# EasyEDA schematic SCH_vs-demon_v1.json
TITLE: Sheet_1; REV: 1.0; Date: 2023-12-21; Sheet: 1/1; Drawn By: aditz26; Company: Your Company
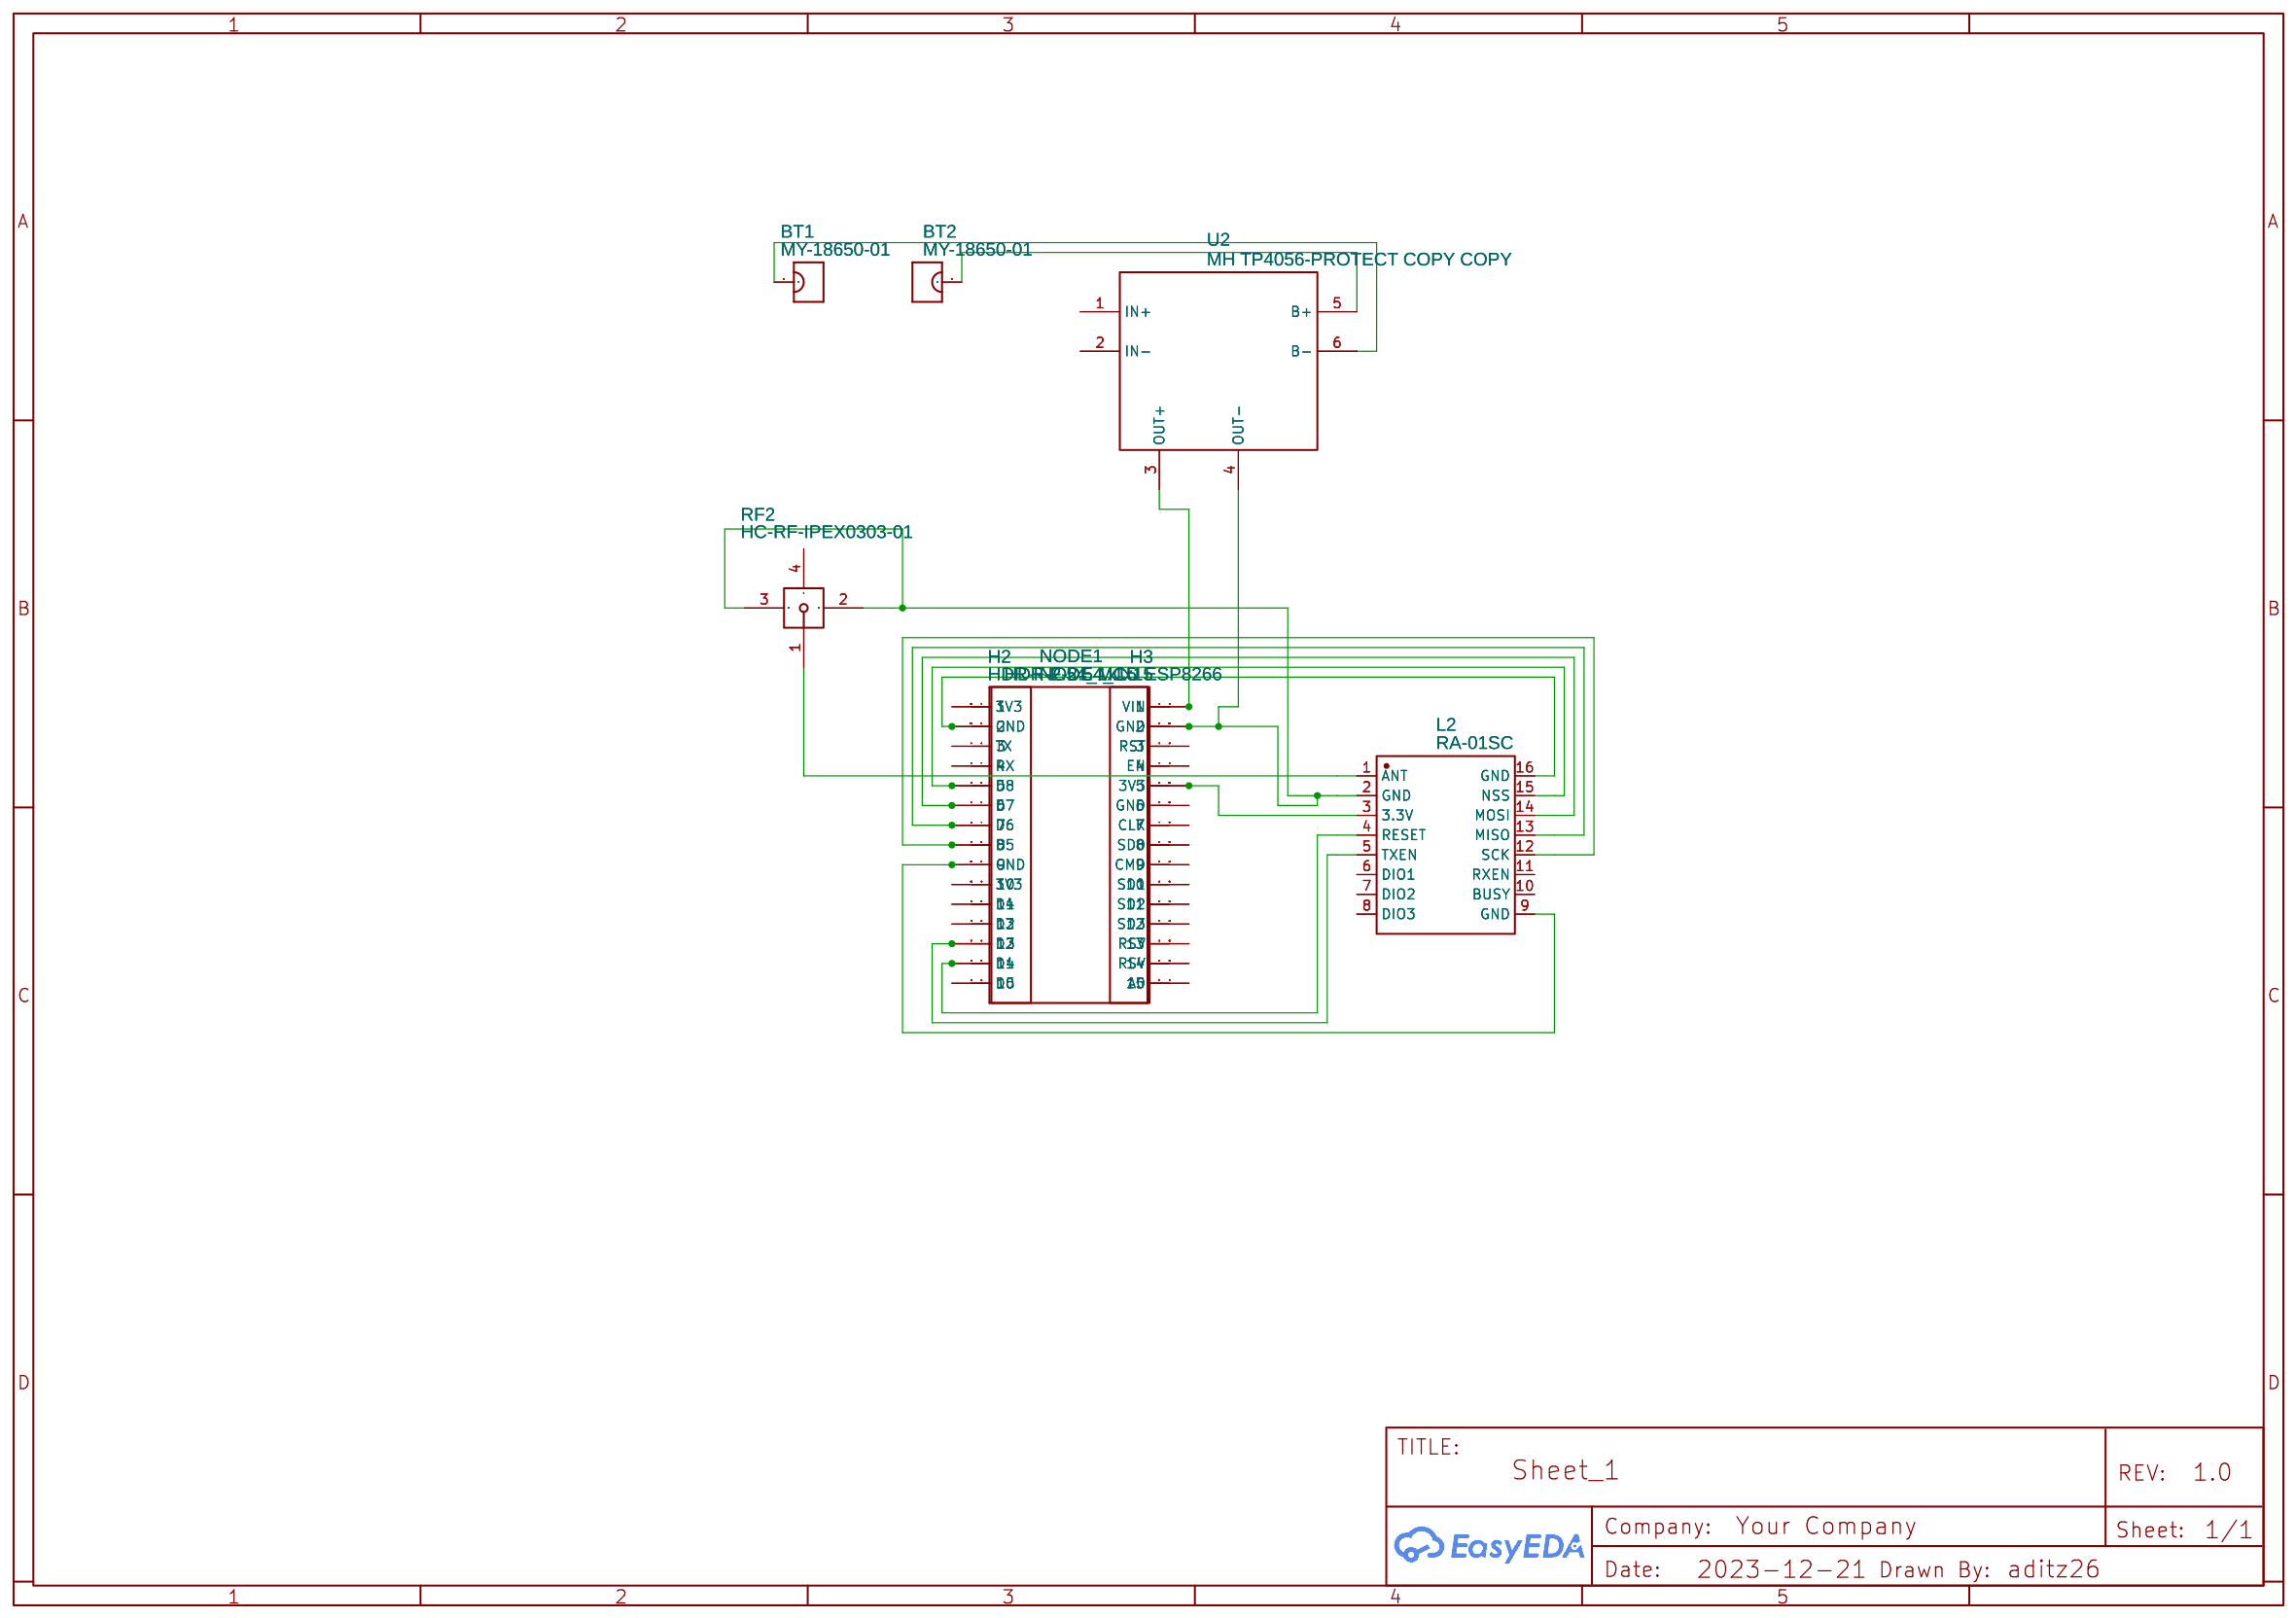
[diagram p0: schematic sheet]

## Parts
BT1  MY-18650-01  [BAT-TH_MY-18650-01]
BT2  MY-18650-01  [BAT-TH_MY-18650-01]
H2  HDR-F-2.54_1x15  [HDR-F-2.54_1X15]
H3  HDR-F-2.54_1x15  [HDR-F-2.54_1X15]
L2  RA-01SC  [COMM-SMD_RA-01S]
NODE1  NODE MCU ESP8266  [NODEMCU-12E; NODEMCU-ESP8266]
RF2  HC-RF-IPEX0303-01  [IPEX-SMD_HC-RF-IPEX0303-01]
U2  MH TP4056-PROTECT COPY COPY  [MH TP4056-PROTECT]

## Library data of the parts
BT1 BT2 = MY-18650-01: Contributor: LCSC; Supplier: LCSC; Supplier Part: C2979183; Manufacturer: MYOUNG(美阳); JLCPCB Part Class: Extended Part
H2 H3 = HDR-F-2.54_1x15: Supplier Part: C124408; Supplier: LCSC; Contributor: LCEDA_Lib
L2 = RA-01SC: Contributor: LCSC; Supplier: LCSC; Supplier Part: C2830749; Manufacturer: Ai-Thinker(安信可); Manufacturer Part: Ra-01SC; JLCPCB Part Class: Extended Part
NODE1 = NODE MCU ESP8266: Contributor: vyoga.alvrizki.te20
RF2 = HC-RF-IPEX0303-01: Contributor: LCSC; Supplier: LCSC; Supplier Part: C2894919; Manufacturer: HCTL(华灿天禄); JLCPCB Part Class: Extended Part; link: https://lcsc.com/eda_search?q=C2894919&%26type=1&ref=editor
U2 = MH TP4056-PROTECT COPY COPY: Contributor: mariusz.kacki

## Nets
Net-(BT1-1): BT1.1 U2.6(B-)
Net-(BT2-1): BT2.1 U2.5(B+)
Net-(H2-2): H2.2 L2.16(GND) NODE1.GND@1(GND)
Net-(H2-5): H2.5 L2.15(NSS) NODE1.D8
Net-(H2-6): H2.6 L2.14(MOSI) NODE1.D7
Net-(H2-7): H2.7 L2.13(MISO) NODE1.D6
Net-(H2-8): H2.8 L2.12(SCK) NODE1.D5
Net-(H2-9): H2.9 L2.9(GND) NODE1.GND@2(GND)
Net-(H2-13): H2.13 L2.5(TXEN) NODE1.D2
Net-(H2-14): H2.14 L2.4(RESET) NODE1.D1
Net-(H3-1): H3.1 NODE1.VIN U2.3(OUT+)
Net-(H3-2): H3.2 L2.2(GND) NODE1.GND@4(GND) RF2.2 RF2.3 U2.4(OUT-)
Net-(H3-5): H3.5 L2.3(3.3V) NODE1.3V3@3(3V3)
Net-(L2-1): L2.1(ANT) RF2.1

Not connected (* = marked no-connect by the designer): H2 1 3 4 10 11 12 15; H3 3 4 6 7 8 9 10 11 12 13 14 15; L2 6(DIO1) 7(DIO2) 8(DIO3) 10(BUSY) 11(RXEN); NODE1 3V3@1(3V3) 3V3@2(3V3) A0 CLK CMD D0 D3 D4 EN GND@3(GND) RST RSV1(RSV) RSV2(RSV) RX SD1 SD2 SD3 SDO(SD0) TX; RF2 4; U2 1(IN+) 2(IN-)
